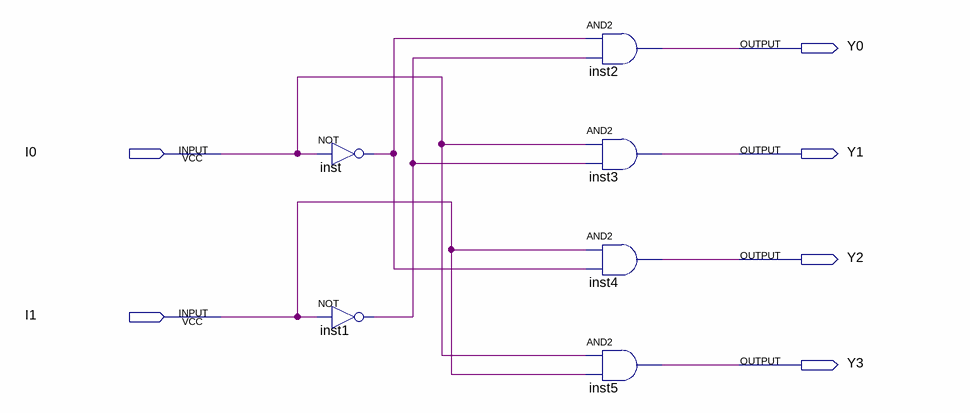
[diagram p0: schematic sheet]
// Quartus schematic 2-4decoder.bdf as structural Verilog: 6 symbols, 6 pins
module \2-4decoder  (
  input  I0,
  input  I1,
  output Y0,
  output Y1,
  output Y2,
  output Y3
);

  wire inst1_out, inst_out;

  not inst (inst_out, I0);
  not inst1 (inst1_out, I1);
  and inst2 (Y0, inst_out, inst1_out);
  and inst3 (Y1, I0, inst1_out);
  and inst4 (Y2, I1, inst_out);
  and inst5 (Y3, I0, I1);
endmodule
